# EAGLE design MD_analog (EAGLE 6.2)
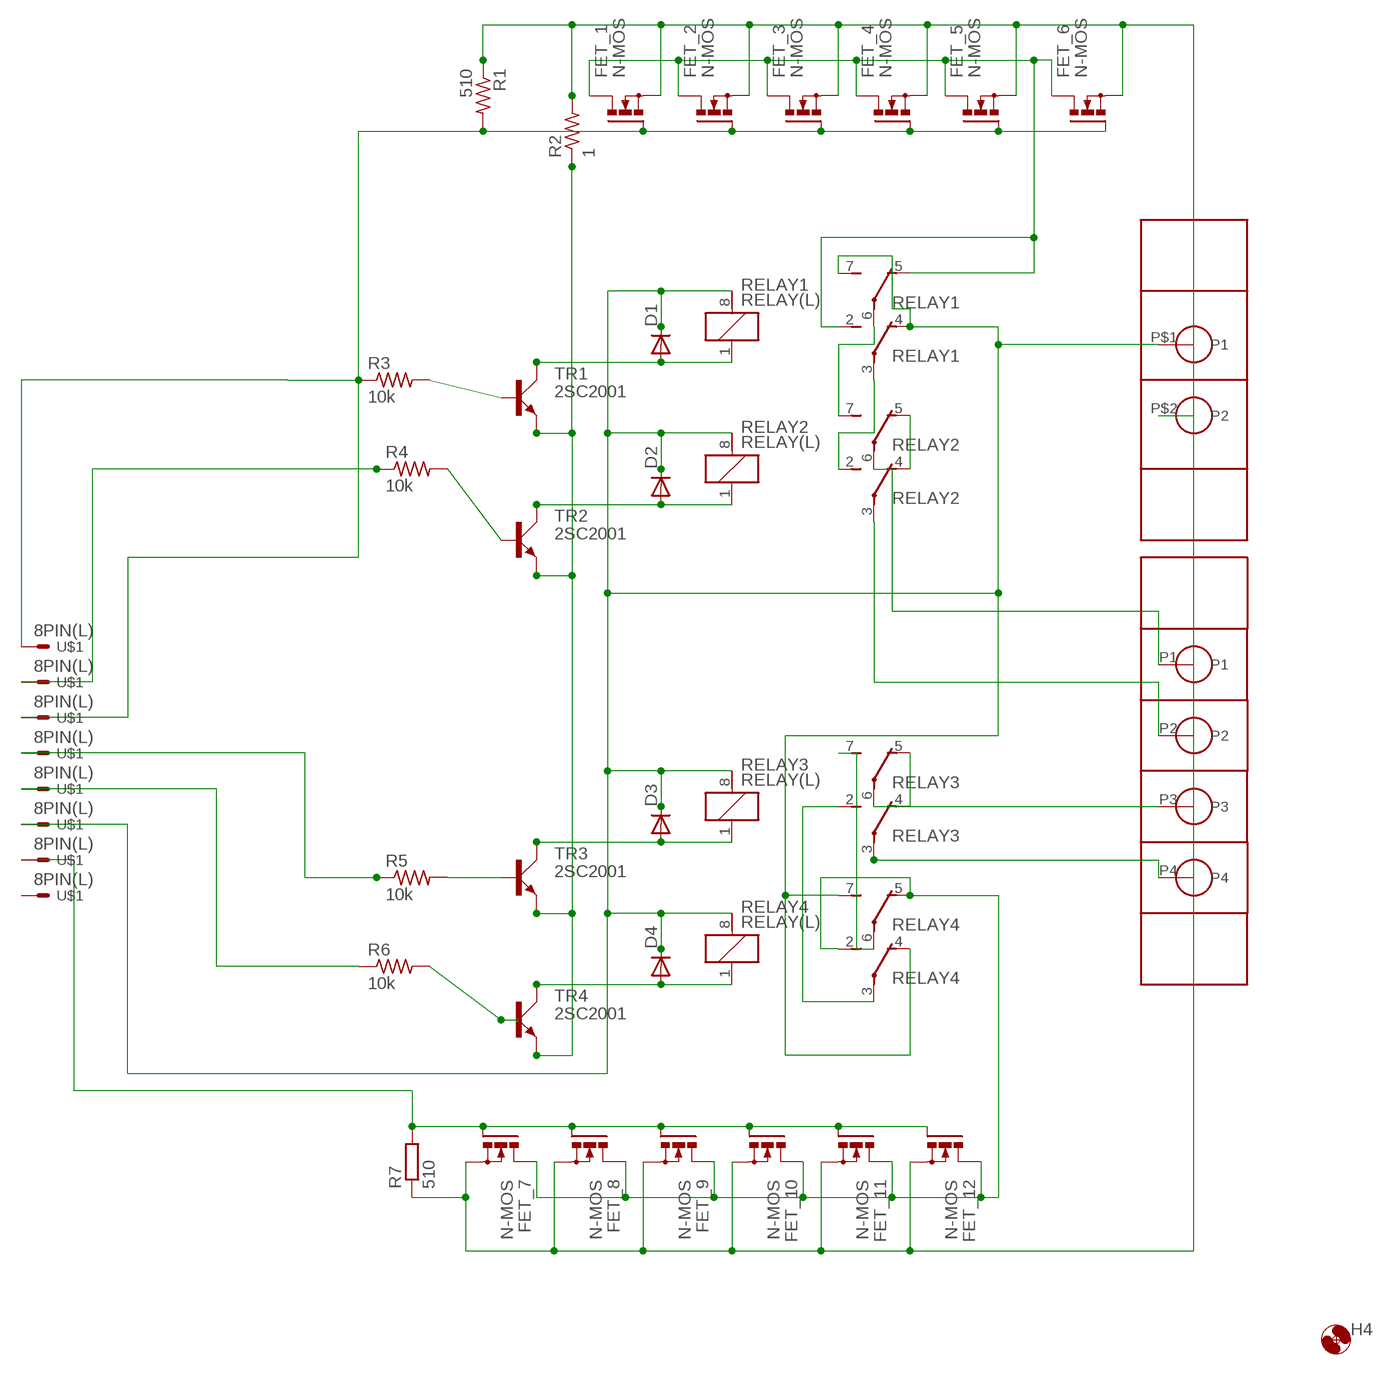
[diagram p0: schematic, sheet 1]

## Parts
D1  DIODE7.5  [DIODE7.5]
D2  DIODE7.5  [DIODE7.5]
D3  DIODE7.5  [DIODE7.5]
D4  DIODE7.5  [DIODE7.5]
FET_1  N-MOS  [TO220BV]
FET_2  N-MOS  [TO220BV]
FET_3  N-MOS  [TO220BV]
FET_4  N-MOS  [TO220BV]
FET_5  N-MOS  [TO220BV]
FET_6  N-MOS  [TO220BV]
FET_7  N-MOS  [TO220BV]
FET_8  N-MOS  [TO220BV]
FET_9  N-MOS  [TO220BV]
FET_10  N-MOS  [TO220BV]
FET_11  N-MOS  [TO220BV]
FET_12  N-MOS  [TO220BV]
H4  HOLE3.3M3BOLT  [HOLE3.3]
R1  510  R-  [0207/10]
R2  1  R-  [0207/10]
R3  10k  R-  [0207/10]
R4  10k  R-  [0207/10]
R5  10k  R-  [0207/10]
R6  10k  R-  [0207/10]
R7  510  R-EU2R0207V  [R0207V]
RELAY1  RELAY(L)  [G2R2]
RELAY2  RELAY(L)  [G2R2]
RELAY3  RELAY(L)  [G2R2]
RELAY4  RELAY(L)  [G2R2]
TR1  2SC2001  [TO92BCE]
TR2  2SC2001  [TO92BCE]
TR3  2SC2001  [TO92BCE]
TR4  2SC2001  [TO92BCE]
U$1  8PIN(L)  [8PL]
U$2  BP341L  [BP341L]
U$4  BP341L_1  [BP341L]

## Nets
12V: D1.PK(C) D2.PK(C) D3.PK(C) D4.PK(C) RELAY1.4(R2:O) RELAY1.7(R1:S) RELAY1.8 RELAY2.8 RELAY3.8 RELAY4.4(R2:O) RELAY4.7(R1:S) RELAY4.8 U$1.P3 U$4.P$1(P1)
FET_G1: FET_1.G FET_2.G FET_3.G FET_4.G FET_5.G FET_6.G R1.2 U$1.P6
FET_G2: FET_7.G FET_8.G FET_9.G FET_10.G FET_11.G FET_12.G R7.2 U$1.P2
GND2: FET_1.S FET_2.S FET_3.S FET_4.S FET_5.S FET_6.S FET_7.S FET_8.S FET_9.S FET_10.S FET_11.S FET_12.S R1.1 R2.2 R7.1 U$4.P$2(P2)
GND3: R2.1 TR1.E TR2.E TR3.E TR4.E
MOS_D1: FET_7.D FET_8.D FET_9.D FET_10.D FET_11.D FET_12.D RELAY4.2(R2:S) RELAY4.5(R1:O)
MOS_D2: FET_1.D FET_2.D FET_3.D FET_4.D FET_5.D FET_6.D RELAY1.2(R2:S) RELAY1.5(R1:O)
N$23: R3.1 U$1.P8
N$24: R4.1 U$1.P7
N$25: R5.1 U$1.P5
N$26: R6.1 U$1.P4
N$27: R6.2 TR4.B
N$29: D1.PA(A) RELAY1.1 TR1.C
N$30: D2.PA(A) RELAY2.1 TR2.C
N$31: D3.PA(A) RELAY3.1 TR3.C
N$32: D4.PA(A) RELAY4.1 TR4.C
N$34: RELAY3.6(R1:P) U$2.P3
N$40: RELAY1.6(R1:P) RELAY2.7(R1:S)
N$41: RELAY1.3(R2:P) RELAY2.2(R2:S)
N$42: RELAY2.4(R2:O) RELAY2.5(R1:O)
N$43: R3.2 TR1.B
N$44: R4.2 TR2.B
N$45: R5.2 TR3.B
N$46: RELAY2.3(R2:P) U$2.P2
N$47: RELAY2.6(R1:P) U$2.P1
N$48: RELAY3.3(R2:P) U$2.P4
N$50: RELAY3.7(R1:S) RELAY4.6(R1:P)
N$51: RELAY3.2(R2:S) RELAY4.3(R2:P)
N$53: RELAY3.4(R2:O) RELAY3.5(R1:O)
Unconnected: U$1.P1

## Library data of the parts
D1-D4 = diode:DIODE7.5
FET_1-FET_12 = FET_kai:N-MOS
H4 = FP-21T for MITS:HOLE3.3
R1-R6 = My_rcl:R-: Resistor
R7 = FP-21T for MITS:R-EU2
RELAY1-RELAY4 = relay:RELAY(L)
TR1-TR4 = My_transistor:2SC2001: NPN Transistor
U$1 = my_connector:8PIN(L)
U$2 = BP341_4PIN:BP341L
U$4 = BP341L_1:BP341L_1

## Board
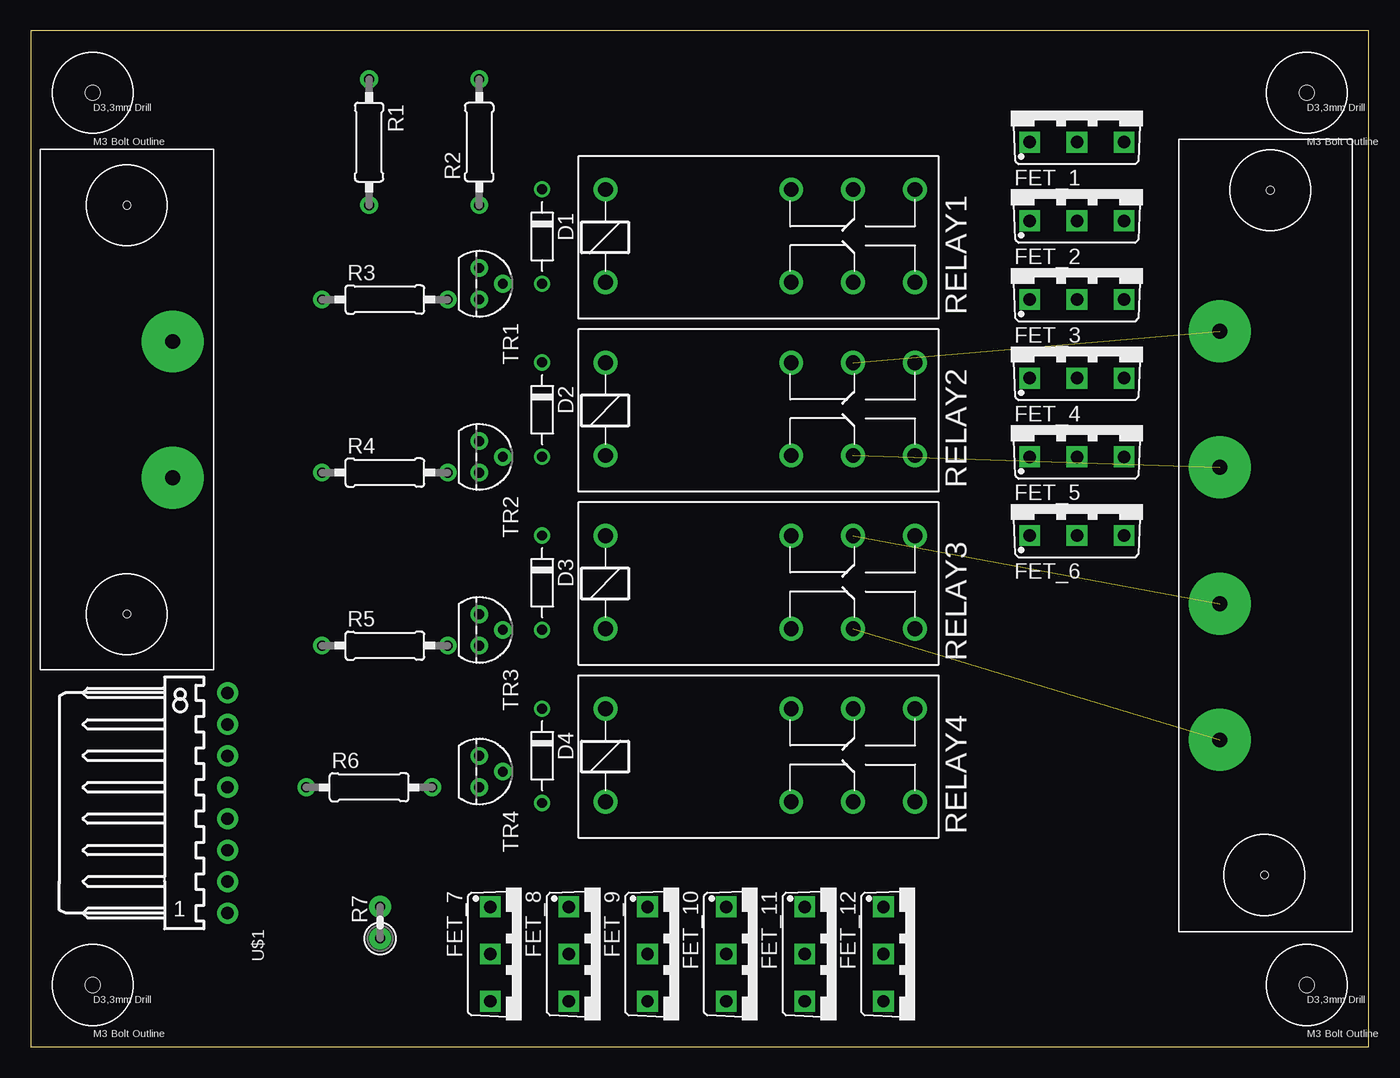
[diagram p1: board, top side]
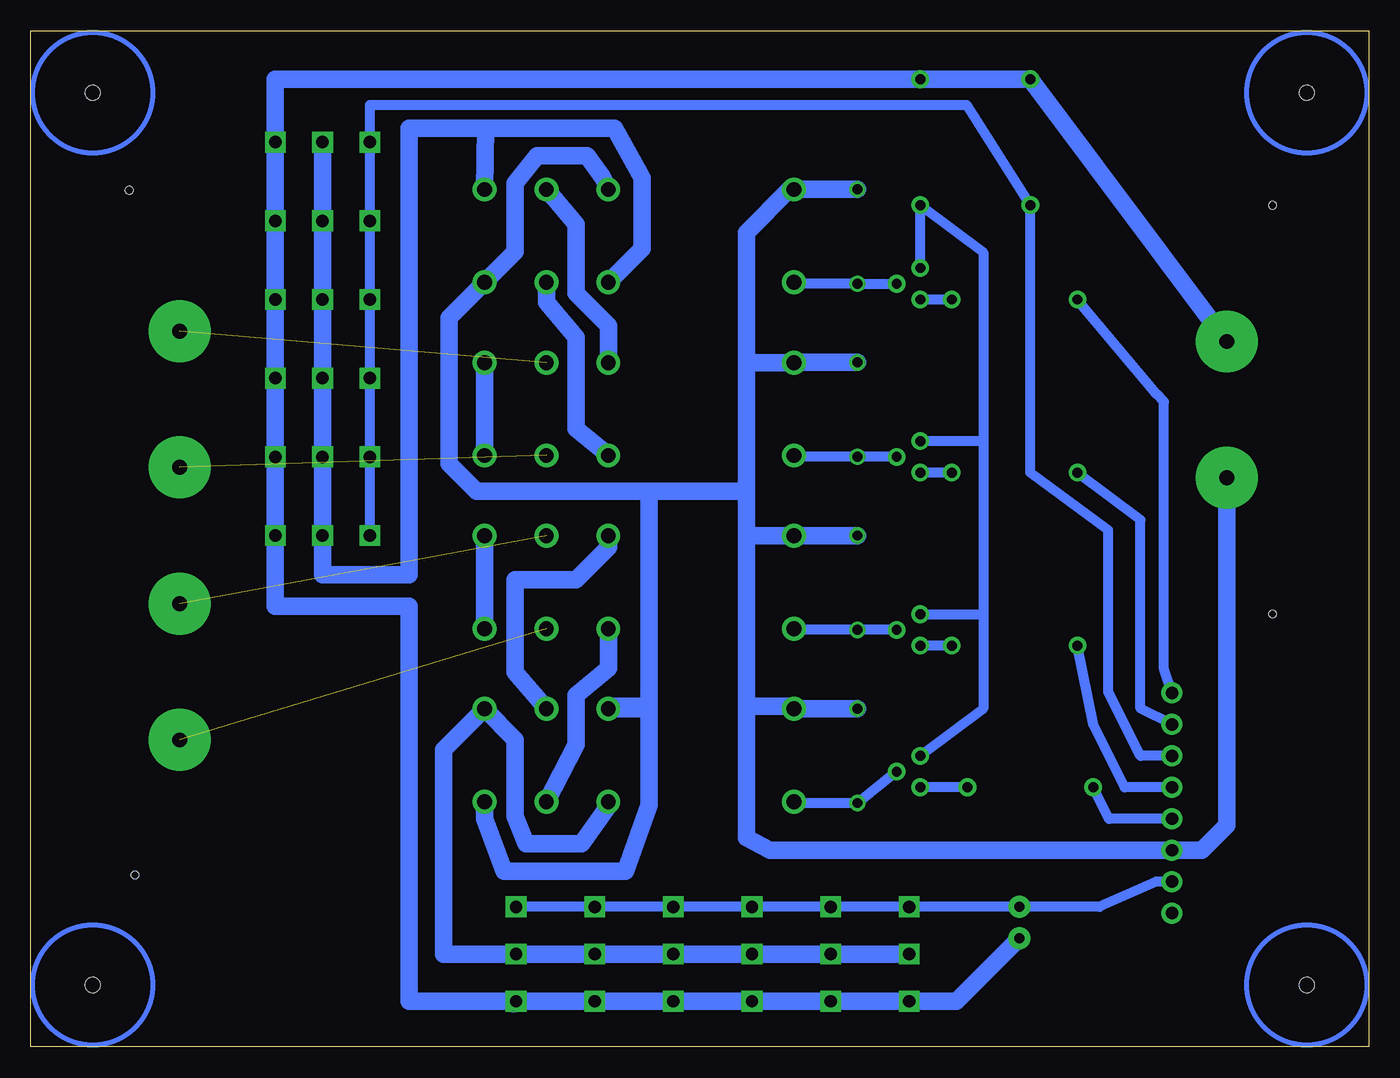
[diagram p2: board, bottom side, seen from below]

Size 108 x 82 mm. Coordinates in mm from the lower left corner, seen from the top.
Outline: 0,0 108,0 108,82 0,82 0,0
Copper layers (1*16): Top 0.035mm / dielectric 1.5mm / Bottom 0.035mm
Design rules: minimum track width 10mil, minimum drill 24mil, track to track 8mil, track to pad 8mil, pad to pad 8mil, via to via 8mil, smd to smd 8mil, copper to edge 40mil, drill to drill 8mil, minimum pad ring 10mil, minimum via ring 8mil, stop-mask expansion 4mil, vias tented up to drill 0mil, thermal gap 10mil

### Footprints (pad centres in the part's own frame; a part is rotated, then mirrored left to right if it is on the bottom)
DIODE7.5 = drill 0.8: PA 3.81,0; PK -3.81,0
TO220BV = drill 1 pad 1.676 square: D 0,0; G -3.81,0; S 3.81,0
HOLE3.3 = hole 1.2: 0,0
0207/10 = drill 0.8 pad 1.422: 1 -5.08,0; 2 5.08,0
R0207V = drill 0.8 pad 1.778: 1 -1.27,0; 2 1.27,0
G2R2 = drill 1.2 pad 1.93: 1 -11.4,-3.7; 2 3.6,-3.7; 3 8.6,-3.7; 4 13.6,-3.7; 5 13.6,3.8; 6 8.6,3.8; 7 3.6,3.8; 8 -11.4,3.8
TO92BCE = drill 0.8 pad 1.422: B 1.27,0; C 0,1.905; E -1.27,0
8PL = drill 1 pad 1.676: P1 8.89,5.08; P2 6.35,5.08; P3 3.81,5.08; P4 1.27,5.08; P5 -1.27,5.08; P6 -3.81,5.08; P7 -6.35,5.08; P8 -8.89,5.08
BP341L = drill 1.2 pad 5: P1 -16.5,-3.7; P2 -5.5,-3.7; P3 5.5,-3.7; P4 16.5,-3.7 | hole 0.6: -27.87,0.37; 27.4,-0.1
BP341L' = drill 1.2 pad 5: P$1 -5.499,-3.698; P$2 5.499,-3.698 | hole 0.6: -16.5,0; 16.5,0

### Placement (x,y rotation side)
D1  41.27,65.41 270 top
D2  41.27,51.44 270 top
D3  41.27,37.47 270 top
D4  41.27,23.5 270 top
FET_1  84.45,73.03 0 top
FET_2  84.45,66.67 0 top
FET_3  84.45,60.33 0 top
FET_4  84.45,53.98 0 top
FET_5  84.45,47.62 0 top
FET_6  84.45,41.27 0 top
FET_7  37.08,7.49 270 top
FET_8  43.43,7.49 270 top
FET_9  49.78,7.49 270 top
FET_10  56.13,7.49 270 top
FET_11  62.48,7.49 270 top
FET_12  68.83,7.49 270 top
H1  HOLE3.3M3BOLT  [HOLE3.3]  5,5 0 top
H2  HOLE3.3M3BOLT  [HOLE3.3]  5,77 0 top
H3  HOLE3.3M3BOLT  [HOLE3.3]  103,77 0 top
H4  103,5 0 top
R1  27.3,73.03 270 top
R2  36.2,73.03 90 top
R3  28.57,60.33 0 top
R4  28.57,46.35 0 top
R5  28.57,32.38 0 top
R6  27.3,20.95 0 top
R7  28.19,10.03 90 top
RELAY1  57.78,65.41 0 top
RELAY2  57.78,51.44 0 top
RELAY3  57.78,37.47 0 top
RELAY4  57.78,23.5 0 top
TR1  36.2,61.59 270 top
TR2  36.2,47.62 270 top
TR3  36.2,33.66 270 top
TR4  36.2,22.23 270 top
U$1  10.79,19.68 270 top
U$2  99.69,41.27 270 top
U$4  BP341L_1  [BP341L']  7.75,51.44 90 top

### Tracks (layer width: path | path; a pad name or v marks a point on that pad's centre or on a via)
12V
  Bottom 1.422: D1.PK 46.38,69.22 RELAY1.8 46.75,69.2 50.23,65.72 50.23,55.23 | D2.PK 46.38,55.24 RELAY2.8 50.23,55.23 | 50.23,55.23 50.23,44.83 | 50.23,44.83 50.23,41.27 RELAY3.8 | RELAY3.8 41.27,41.27 D3.PK | RELAY3.8 50.23,41.27 50.23,27.5 | 50.23,27.5 46.38,27.5 RELAY4.8 D4.PK | RELAY4.4 71.39,18.43 69.79,14.16 60.01,14.16 58.1,19.49 58.1,27.5 | 58.1,27.5 61.18,27.5 RELAY4.7 58.43,27.3 58.1,27.5 | 58.1,27.5 58.1,44.83 | 58.1,44.83 50.23,44.83 | 50.23,27.5 50.23,16.89 48.32,15.88 U$1.P3 13.46,15.88 11.45,17.89 U$4.P$1 | RELAY1.7 61.83,70.21 63.12,71.94 67.12,71.94 68.9,69.72 68.9,64.19 RELAY1.4 74.23,58.86 74.23,47.05 72.01,44.83 58.1,44.83
FET_G1
  Bottom 0.813: FET_6.G FET_5.G FET_4.G FET_3.G FET_2.G FET_1.G 80.64,76.01 32.45,76.01 R1.2 27.3,46.35 21.02,41.72 21.02,28.64 18.41,23.5 U$1.P6
FET_G2
  Bottom 0.813: U$1.P2 17.14,13.34 21.72,11.3 R7.2 FET_7.G FET_8.G FET_9.G FET_10.G FET_11.G FET_12.G
GND2
  Bottom 1.422: 69.03,3.49 FET_12.S | FET_12.S FET_11.S FET_10.S FET_9.S FET_8.S FET_7.S 33.27,3.68 R7.1 | U$4.P$2 R1.1 R2.2 88.27,78.11 FET_1.S FET_2.S FET_3.S FET_4.S FET_5.S FET_6.S 88.27,35.56 77.47,35.56 77.47,3.68 FET_12.S
GND3
  Bottom 0.813: 31.11,48.9 31.11,64.14 R2.1 TR1.E | 31.11,48.9 TR2.E | 31.11,48.9 31.11,34.92 | TR3.E 31.11,34.92 | 31.11,34.92 31.11,27.3 TR4.E
MOS_D1
  Bottom 1.422: FET_7.D FET_8.D FET_9.D FET_10.D FET_11.D | FET_11.D FET_12.D | FET_11.D 74.68,7.49 74.68,13.27 74.68,15.24 74.68,24 RELAY4.5 68.9,24.81 68.9,18.61 68.01,16.38 63.56,16.38 61.38,19.45 RELAY4.2
MOS_D2
  Bottom 1.422: FET_1.D FET_2.D FET_3.D FET_4.D FET_5.D FET_6.D 84.45,38.1 77.47,38.1 77.47,74.17 71.31,74.17 | RELAY1.2 58.67,64.42 58.67,70.17 60.9,74.17 71.31,74.17 | 71.31,74.17 RELAY1.5
N$23
  Bottom 0.813: R3.1 17.14,52.7 16.51,52.07 16.51,30.48 U$1.P8
N$24
  Bottom 0.813: U$1.P7 18.41,27.3 18.41,42.55 R4.1
N$25
  Bottom 0.813: U$1.P5 19.68,20.95 22.23,26.04 R5.1
N$26
  Bottom 0.813: U$1.P4 20.95,18.41 R6.1
N$27
  Bottom 0.813: R6.2 TR4.B
N$29
  Bottom 0.813: RELAY1.1 46.38,61.59 D1.PA TR1.C
N$30
  Bottom 0.813: TR2.C D2.PA 46.27,47.62 RELAY2.1
N$31
  Bottom 0.813: TR3.C D3.PA 46.38,33.66 RELAY3.1
N$32
  Bottom 0.813: TR4.C D4.PA 46.27,19.68 RELAY4.1
N$34  (1 unrouted)
N$40
  Bottom 1.422: RELAY2.7 61.38,58.21 64.01,60.83 64.01,66.38 RELAY1.6
N$41
  Bottom 1.422: RELAY1.3 66.39,60.1 64.01,57.28 64.01,49.91 RELAY2.2
N$42
  Bottom 1.422: RELAY2.5 RELAY2.4
N$43
  Bottom 0.813: R3.2 TR1.B
N$44
  Bottom 0.813: R4.2 TR2.B
N$45
  Bottom 0.813: R5.2 TR3.B
N$46  (1 unrouted)
N$47  (1 unrouted)
N$48  (1 unrouted)
N$50
  Bottom 1.422: RELAY3.7 61.38,40.34 64.01,37.72 68.9,37.72 68.9,30.25 RELAY4.6
N$51
  Bottom 1.422: RELAY3.2 61.38,30.56 64.01,28.38 64.01,24.39 RELAY4.3
N$53
  Bottom 1.422: RELAY3.5 RELAY3.4
(copper drawn outside any net)
  shapes: Bottom circle x4